# EAGLE design Filamint Schematic V4.5 (EAGLE 7.5.0)
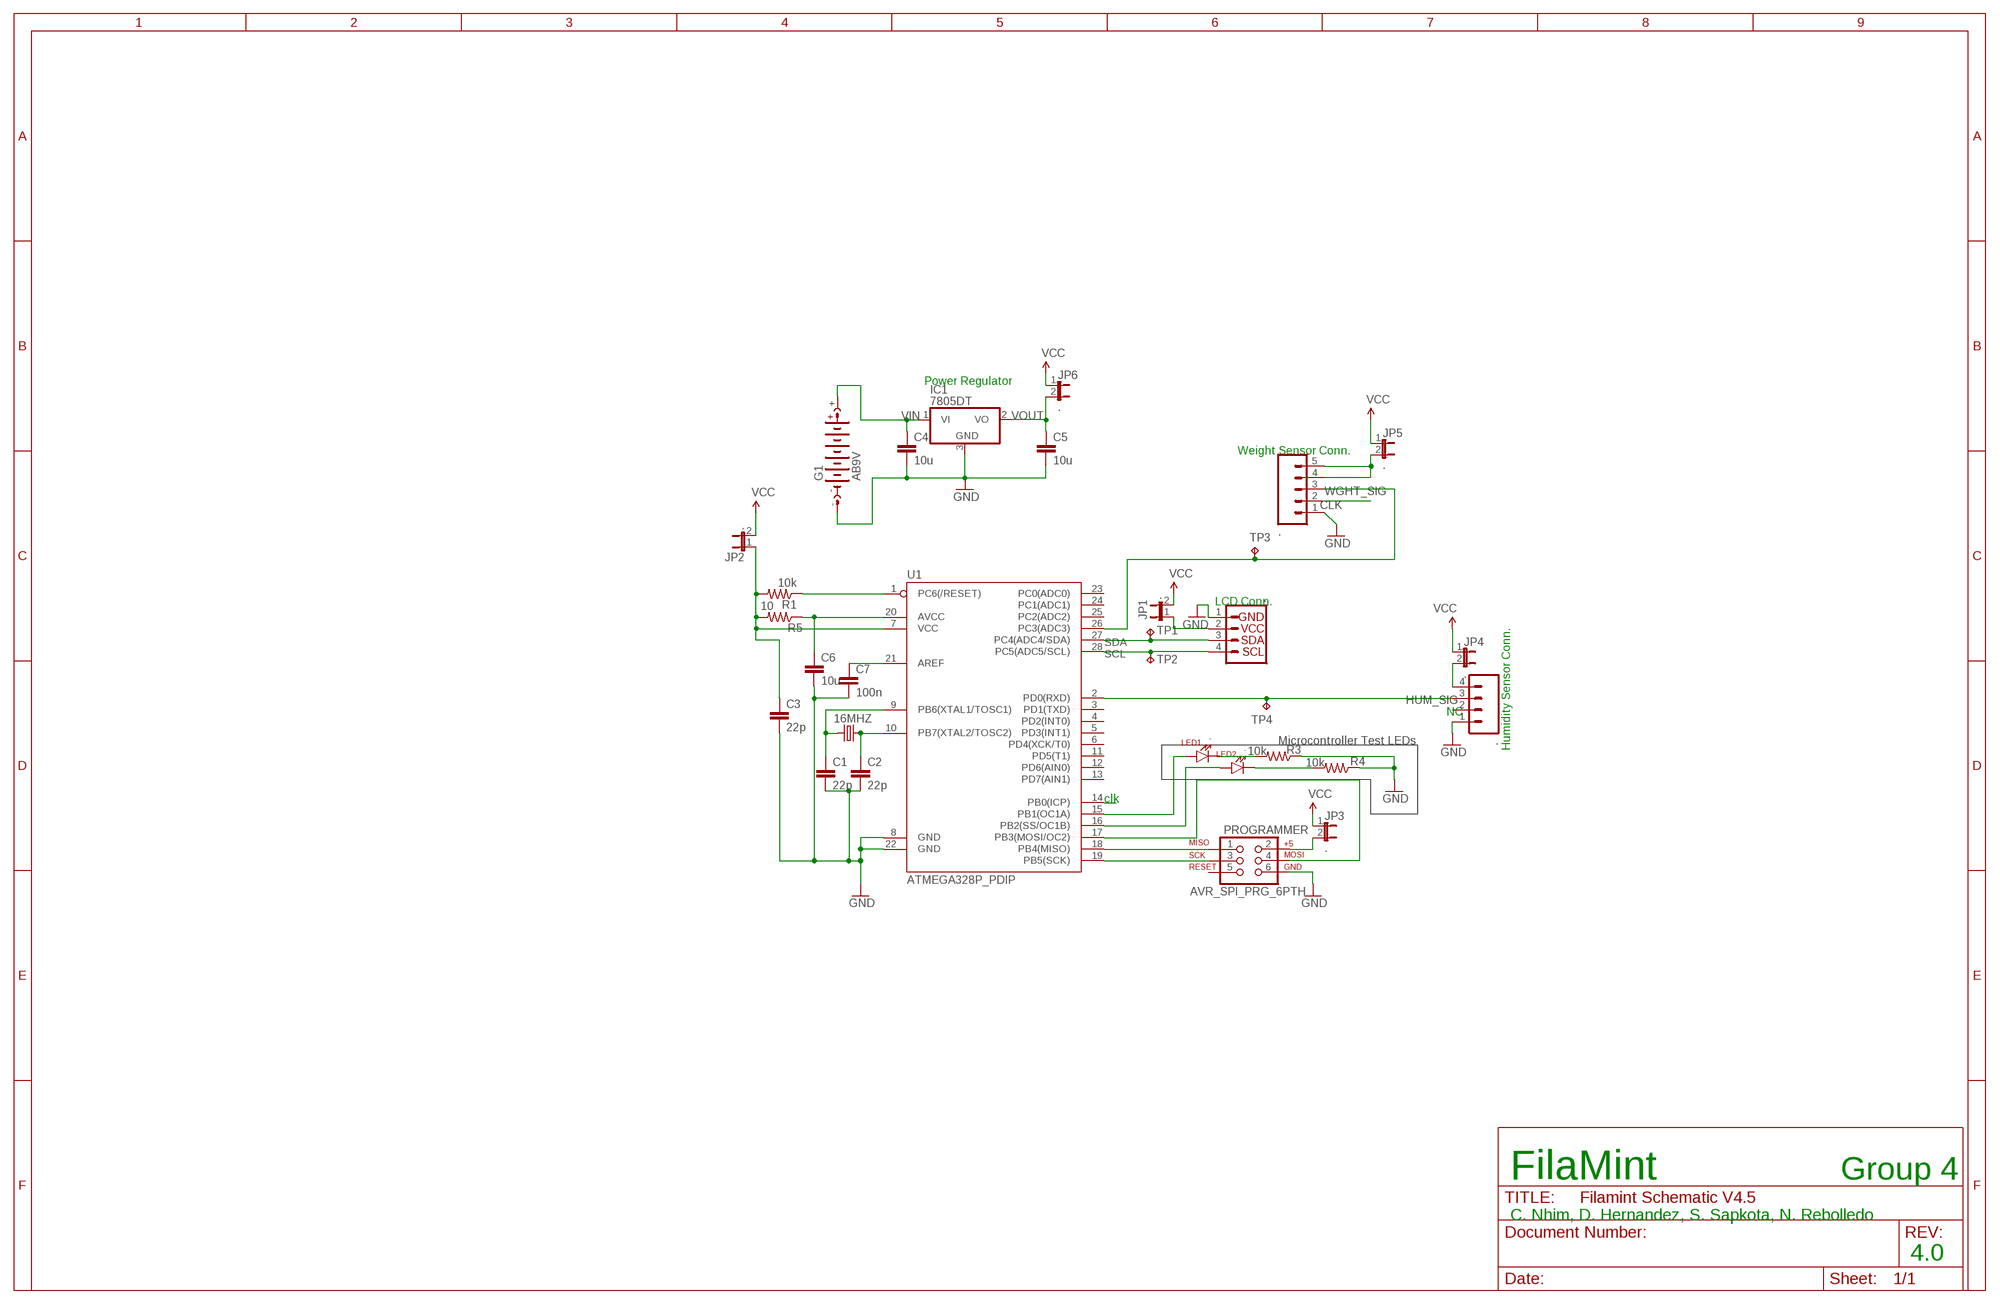
[diagram p0: schematic, sheet 1]

## Parts
16MHZ  CSM-7X-DU  [CSM-7X-DU]
C1  22p  C-EU025-024X044  [C025-024X044]
C2  22p  C-EU025-024X044  [C025-024X044]
C3  22p  C-EU025-024X044  [C025-024X044]
C4  10u  C-EU025-024X044  [C025-024X044]
C5  10u  C-EU025-024X044  [C025-024X044]
C6  10u  C-EU025-024X044  [C025-024X044]
C7  100n  C-EU025-024X044  [C025-024X044]
DHT22  .  M04SMD2  [1X04-1MM-RA]
G1  AB9V  [AB9V]
HX711  .  M05SMD  [1X05-1MM]
IC1  7805DT  [TO252]
JP1  .  JP1E  [JP1]
JP2  .  JP1E  [JP1]
JP3  .  JP1E  [JP1]
JP4  .  JP1E  [JP1]
JP5  .  JP1E  [JP1]
JP6  .  JP1E  [JP1]
LCD  .  I2C_STANDARD  [1X04]
LED1  .  LTE-302  [LTE-302]
LED2  .  LTE-302  [LTE-302]
PROGRAMMER  AVR_SPI_PRG_6PTH  [2X3]
R1  10k  R-US_0204/5  [0204/5]
R3  10k  R-US_0204/5  [0204/5]
R4  10k  R-US_0204/5  [0204/5]
R5  10  R-US_0204/5  [0204/5]
TP1  TPB1,27  [B1,27]
TP2  TPB1,27  [B1,27]
TP3  TPB1,27  [B1,27]
TP4  TPB1,27  [B1,27]
U1  ATMEGA328P_PDIP  [DIL28-3]

## Nets
AVCC: C6.1 R5.1 U1.20(AVCC)
CLK: HX711.2 U1.14(PB0(ICP))
GND: C1.2 C2.2 C3.2 C4.2 C5.2 C6.2 C7.2 DHT22.1 G1.- HX711.1 IC1.3(GND) LCD.1 PROGRAMMER.6 R3.1 R4.1 U1.8(GND) U1.22(GND)
HUM_SIG: DHT22.3 TP4.TP U1.2(PD0(RXD))
N$1: 16MHZ.2 C1.1 U1.9(PB6(XTAL1/TOSC1))
N$2: 16MHZ.1 C2.1 U1.10(PB7(XTAL2/TOSC2))
N$3: HX711.4 HX711.5 JP5.2
N$4: R1.1 U1.1(PC6(/RESET))
N$5: C7.1 U1.21(AREF)
N$6: PROGRAMMER.3 U1.19(PB5(SCK))
N$7: PROGRAMMER.1 U1.18(PB4(MISO))
N$11: LED1.A U1.15(PB1(OC1A))
N$12: PROGRAMMER.4 U1.17(PB3(MOSI/OC2))
N$22: LED2.A U1.16(PB2(SS/OC1B))
N$23: DHT22.4 JP4.2
N$24: LED1.C R3.2
N$25: LED2.C R4.2
N$26: JP3.2 PROGRAMMER.2
N$27: C3.1 JP2.1 R1.2 R5.2 U1.7(VCC)
N$28: JP1.1 LCD.2
N$29: C5.1 IC1.2(VO) JP6.2
SCL: LCD.4 TP2.TP U1.28(PC5(ADC5/SCL))
SDA: LCD.3 TP1.TP U1.27(PC4(ADC4/SDA))
VCC: JP1.2 JP2.2 JP3.1 JP4.1 JP5.1 JP6.1
VIN: C4.1 G1.+ IC1.1(VI)
WGHT_SIG: HX711.3 TP3.TP U1.26(PC3(ADC3))
Unconnected: DHT22.2 PROGRAMMER.5 U1.3(PD1(TXD)) U1.4(PD2(INT0)) U1.5(PD3(INT1)) U1.6(PD4(XCK/T0)) U1.11(PD5(T1)) U1.12(PD6(AIN0)) U1.13(PD7(AIN1)) U1.23(PC0(ADC0)) U1.24(PC1(ADC1)) U1.25(PC2(ADC2))

## Notes on the sheet
- Power Regulator
- VOUT
- Weight Sensor Conn.
- LCD Conn.
- NC
- Microcontroller Test LEDs
- Humidity Sensor Conn.
- clk
- FilaMint | Group 4
- C. Nhim, D. Hernandez, S. Sapkota, N. Rebolledo
- 4.0

## Library data of the parts
16MHZ = crystal:CSM-7X-DU: SMD CRYSTAL Source: www.ecsxtal.com .. Crystal 3.6864MHz CSM_7X_DU.PDF; OC_FARNELL: unknown; OC_NEWARK: unknown
C1-C7 = rcl:C-EU: CAPACITOR, European symbol
DHT22 = SparkFun-Connectors:M04: Header 4 Standard 4-pin 0.1" header. Use with straight break away headers (SKU : PRT-00116), right angle break away headers (PRT-00553), swiss pins (PRT-00743), machine pins (PRT-00117), and female headers (PRT-00115). Molex polarized connector foot print use with SKU : PRT-08231 with associated crimp pins and housings. 1MM SMD Version SKU: PRT-10208
G1 = battery:AB9V: 9-V BATTERY CLIP
HX711 = SparkFun-Connectors:M05: Header 5 Standard 5-pin 0.1" header. Use with straight break away headers (SKU : PRT-00116), right angle break away headers (PRT-00553), swiss pins (PRT-00743), machine pins (PRT-00117), and female headers (PRT-00115). Molex polarized connector foot print use with SKU : PRT-08230 with associated crimp pins and housings.
IC1 = linear:78*: Positive VOLTAGE REGULATOR Source: http://cache.national.com/ds/LM/LM78L05.pdf http://www.fairchildsemi.com/ds/LM/LM7805.pdf
JP1-JP6 = jumper:JP1E: JUMPER
LCD = SparkFun-Connectors:I2C_STANDARD: SparkFun has standardized on a pinout for all I2C based sensor breakouts. This pinout allows I2C boards to be plugged directly into the headers on Arduino Uno compatible boards, and to be daisy chained easily.
LED1 LED2 = SparkFun-LED:LTE-302: Through-hole side-firing 940nm IR LED
PROGRAMMER = SparkFun-Connectors:AVR_SPI_PRG_6: AVR ISP 6 Pin This is the reduced ISP connector for AVR programming. Common on Arduino. This footprint will take up less PCB space and can be used with a 10-pin to 6-pin adapter such as SKU: BOB-08508 **Special note about "TEST_POINT" package. The stop mask is on the top side, so if you want your programming test points to be on the bottom of your board, make sure to place this package on the bottom side of the board. This also ensure that the orientation to program from the bottom side will be correct.
R1 R3-R5 = rcl:R-US_: RESISTOR, American symbol
TP1-TP4 = testpad:TP: Test pad
U1 = SparkFun-DigitalIC:ATMEGA328P_PDIP: uC used in the Arduino 32kb flash, 1k EEPROM, 2k SRAM This is the through-hole version of this chip.

## Net classes
0 default: clearance 0.205 mm

## Board
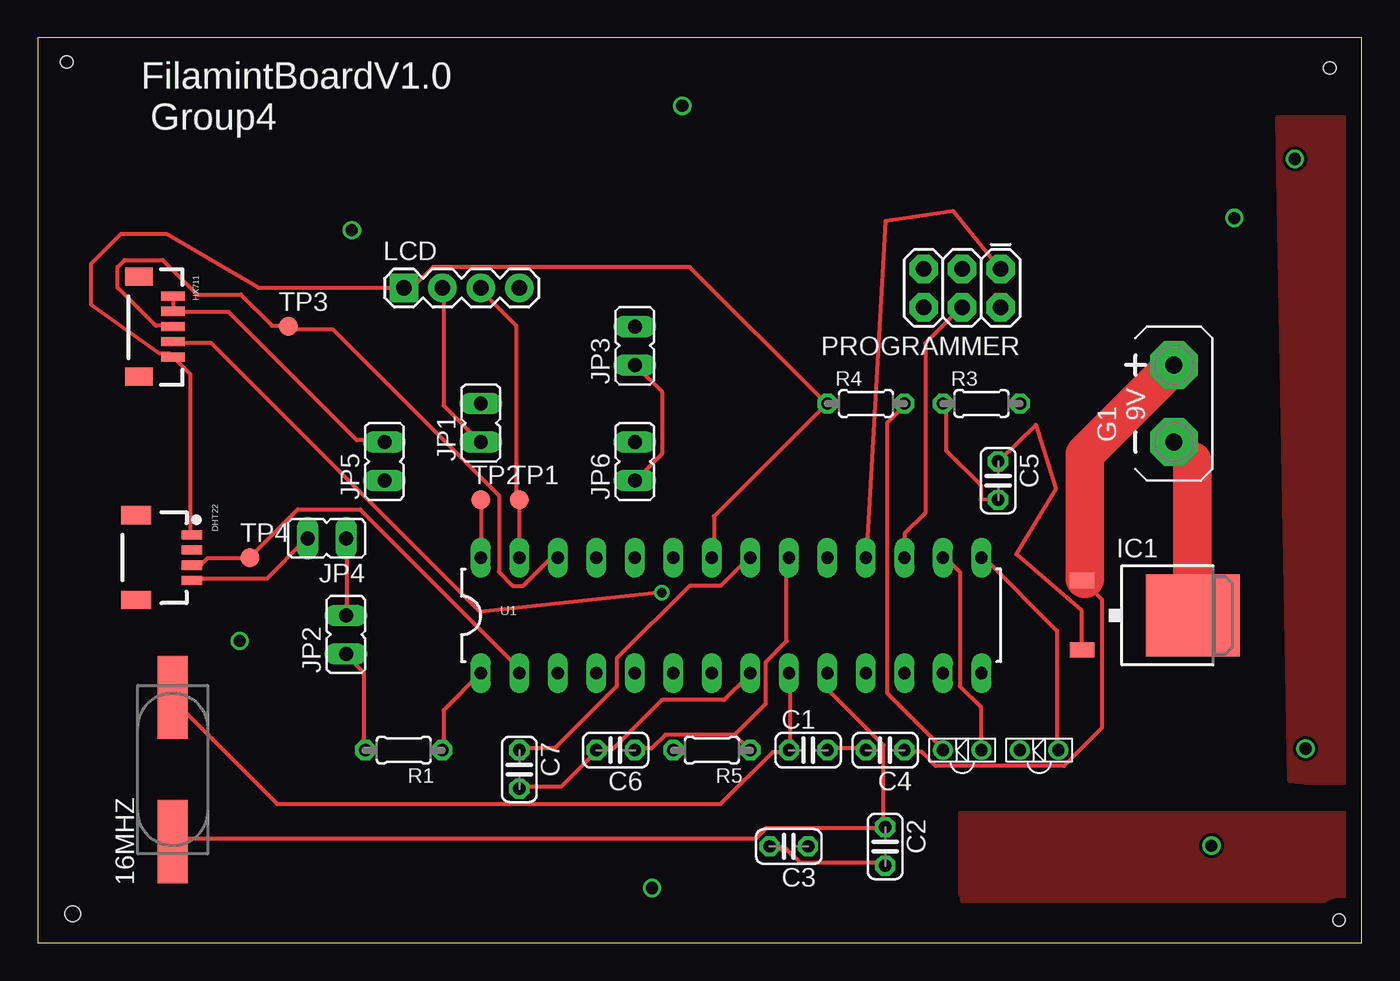
[diagram p1: board, top side]
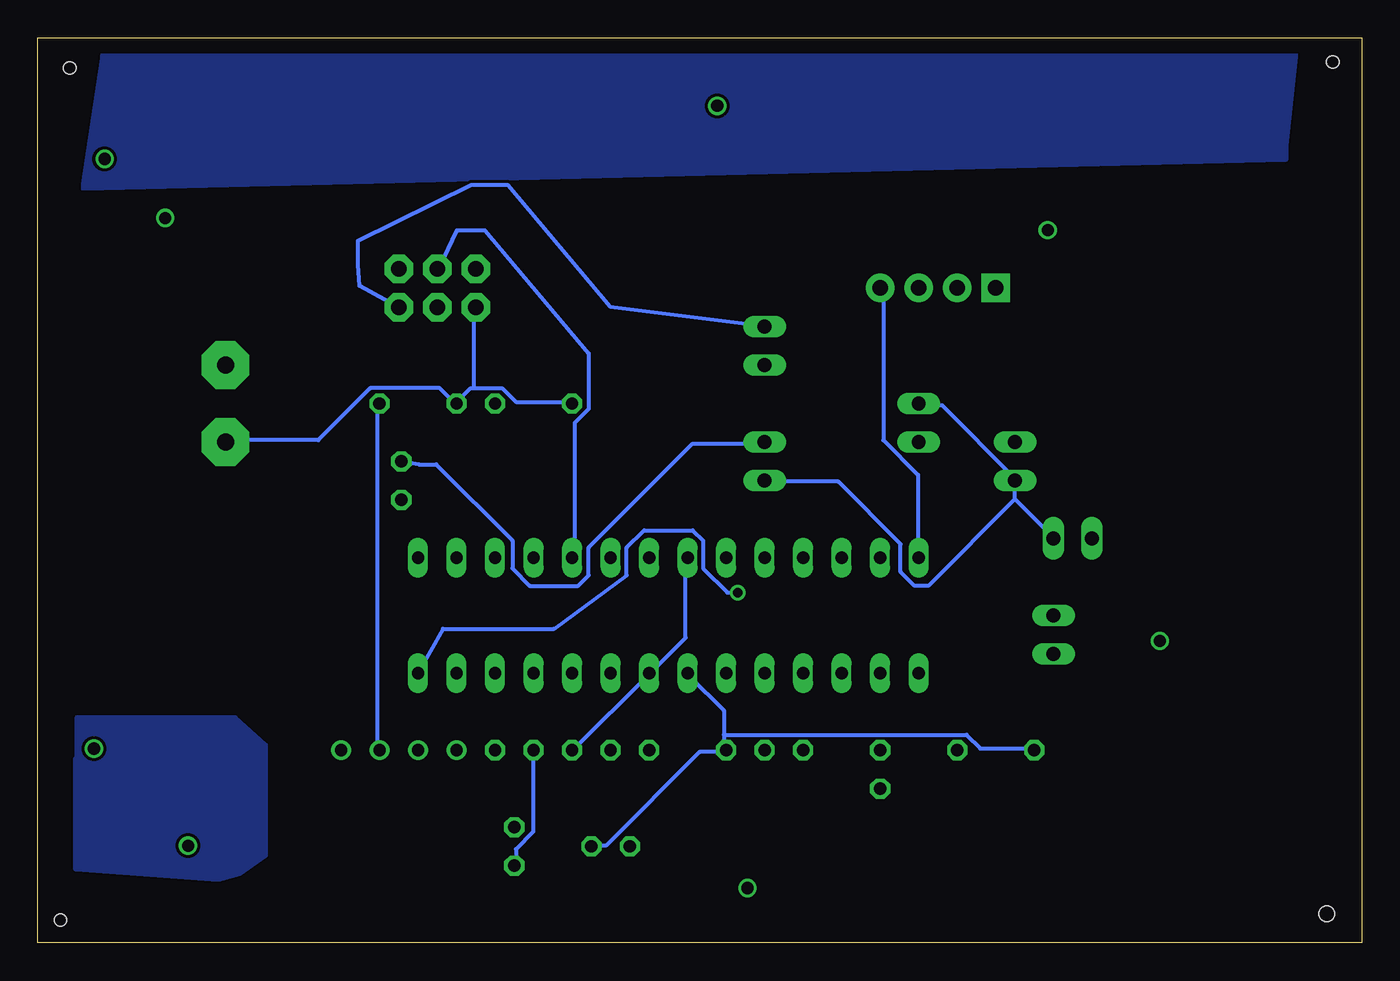
[diagram p2: board, bottom side, seen from below]

Size 87.3 x 59.68 mm. Coordinates in mm from the lower left corner, seen from the top.
Outline: 0,0 87.3,0 87.3,59.68 0,59.68 0,0
Copper layers (1*16): Top 0.035mm / dielectric 1.5mm / Bottom 0.035mm
Design rules "default": minimum track width 10mil, minimum drill 24mil, track to track 8mil, track to pad 8mil, pad to pad 8mil, via to via 8mil, smd to smd 8mil, copper to edge 40mil, drill to drill 8mil, minimum pad ring 10mil, minimum via ring 8mil, stop-mask expansion 4mil, vias tented up to drill 0mil, thermal gap 10mil
Holes 1 mm at 2.3,1.9
Holes 0.8 mm at 85.8,1.5 85.2,57.7 1.9,58.1

### Footprints (pad centres in the part's own frame; a part is rotated, then mirrored left to right if it is on the bottom)
CSM-7X-DU = smd 5.5 x 2: 1 -4.75,0; 2 4.75,0
C025-024X044 = drill 0.813 octagon: 1 -1.27,0; 2 1.27,0
1X04-1MM-RA = smd 0.6 x 1.35: 1 -1.5,0; 2 -0.5,0; 3 0.5,0; 4 1.5,0 | smd 1.2 x 2: NC1 2.8,-3.675; NC2 -2.8,-3.675
AB9V = drill 1.118 pad 3.15 octagon: + 0,2.54; - 0,-2.54
1X05-1MM = smd 0.6 x 1.55: 1 -2,0; 2 -1,0; 3 0,0; 4 1,0; 5 2,0 | smd 1.2 x 1.8: NC1 -3.3,2.225; NC2 3.3,2.225
TO252 = smd 1 x 1.6: 1 -2.28,-4.8; 2 2.28,-4.8 | smd 5.4 x 6.2: 3 0,2.5
JP1 = drill 0.914 long: 1 0,-1.27; 2 0,1.27
1X04 = drill 1.016 pad 1.88 square: 1 0,0 | drill 1.016 pad 1.88: 2 2.54,0; 3 5.08,0; 4 7.62,0
LTE-302 = drill 0.8: A 1.27,0; C -1.27,0
2X3 = drill 1.016 pad 1.88 octagon: 1 0,0; 2 0,2.54; 3 2.54,0; 4 2.54,2.54; 5 5.08,0; 6 5.08,2.54
0204/5 = drill 0.813 octagon: 1 -2.54,0; 2 2.54,0
B1,27 = smd 1.27 x 1.27: TP 0,0
DIL28-3 = drill 0.813 long: 1 -16.51,-3.81; 2 -13.97,-3.81; 3 -11.43,-3.81; 4 -8.89,-3.81; 5 -6.35,-3.81; 6 -3.81,-3.81; 7 -1.27,-3.81; 8 1.27,-3.81; 9 3.81,-3.81; 10 6.35,-3.81; 11 8.89,-3.81; 12 11.43,-3.81; 13 13.97,-3.81; 14 16.51,-3.81; 15 16.51,3.81; 16 13.97,3.81; 17 11.43,3.81; 18 8.89,3.81; 19 6.35,3.81; 20 3.81,3.81; 21 1.27,3.81; 22 -1.27,3.81; 23 -3.81,3.81; 24 -6.35,3.81; 25 -8.89,3.81; 26 -11.43,3.81; 27 -13.97,3.81; 28 -16.51,3.81

### Placement (x,y rotation side)
16MHZ  8.89,11.43 90 top
C1  50.8,12.7 0 top
C2  55.88,6.35 270 top
C3  49.53,6.35 180 top
C4  55.88,12.7 180 top
C5  63.33,30.48 270 top
C6  38.1,12.7 180 top
C7  31.75,11.43 270 top
DHT22  10.16,25.4 270 top
G1  74.93,35.56 0 top
HX711  8.89,40.64 90 top
IC1  73.66,21.59 270 top
JP1  29.21,34.29 0 top
JP2  20.32,20.32 0 top
JP3  39.37,39.37 0 top
JP4  19.05,26.67 90 top
JP5  22.86,31.75 0 top
JP6  39.37,31.75 0 top
LCD  24.13,43.18 0 top
LED1  66.04,12.7 0 top
LED2  60.96,12.7 0 top
PROGRAMMER  63.5,44.45 180 top
R1  24.13,12.7 180 top
R3  62.23,35.56 0 top
R4  54.61,35.56 0 top
R5  44.45,12.7 180 top
TP1  31.75,29.21 0 top
TP2  29.21,29.21 0 top
TP3  16.51,40.64 0 top
TP4  13.97,25.4 0 top
U1  45.72,21.59 0 top

### Tracks (layer width: path | path; a pad name or v marks a point on that pad's centre or on a via)
AVCC
  Top 0.254: 45.95,13.72 41.38,13.72 40.46,12.8 39.55,12.8 C6.1 | 45.95,13.72 46.86,12.8 R5.1 | 45.95,13.72 48.01,15.77 48.01,18.52 49.38,19.89 49.38,25.38 U1.20
CLK  (via drill 0.61)
  Top 0.254: v41.15,23.09 29.16,21.82 11.43,39.55 8.91,39.55 HX711.2
  Bottom 0.254: v41.15,23.09 41.83,23.09 43.43,24.69 43.43,26.52 44.12,27.2 47.32,27.2 48.46,26.06 48.46,24.23 53.26,20.7 60.58,20.7 U1.14
GND
  Top 0.254: C3.2 48.46,6.17 49.38,6.17 50.29,5.26 55.78,5.26 C2.2 | C7.2 31.77,10.29 34.52,10.29 36.8,12.57 C6.2 37.03,12.8 37.95,12.8 41.15,16 45.26,16 46.86,17.6 U1.8 | C1.2 52.12,12.8 54.41,12.8 C4.2 | DHT22.1 10.06,26.98 10.06,37.49 8.91,38.63 HX711.1 8.69,38.86 8,38.86 3.53,42.06 3.53,44.81 5.49,46.76 8.46,46.76 14.55,43.2 24,43.2 LCD.1 24.23,43.2 24.69,43.2 26.06,44.58 42.98,44.58 51.89,35.66 R4.1 51.89,35.43 44.58,28.12 44.58,25.6 U1.22 | 76.12,31.77 74.98,32.92 G1.- | 76.12,21.72 IC1.3 | C5.2 62.18,29.26 62.18,30.18 59.89,32.46 59.89,35.43 R3.1
  Top 2.54: 76.12,31.77 76.12,21.72
  Bottom 0.254: C1.2 51.89,12.8 47.09,17.6 U1.8 46.86,17.83 44.58,20.12 44.58,25.38 U1.22 | C2.2 55.78,5.26 55.78,6.17 54.63,7.32 54.63,12.57 C4.2 | 58.52,36.58 58.75,36.58 59.66,35.66 R3.1 59.89,35.66 60.81,36.58 65.38,36.58 68.81,33.15 74.75,33.15 G1.- | 58.52,36.58 56.69,36.58 55.78,35.66 52.12,35.66 R4.1 | 58.52,36.58 58.52,41.83 PROGRAMMER.6
  pour Top (isolate 0.01): 86.4,2.8 61,2.8 61,3.2 60.9,3.2 60.9,8.5 86.2,8.5 86.2,8.6
  pour Bottom (isolate 0.01): 4.3,59.1 83,59.1 83,58.5 84.3,49.8 5,51.7 5,52.6
HUM_SIG
  Top 0.254: DHT22.3 10.29,24.92 10.74,24.92 11.2,25.38 13.95,25.38 TP4.TP 17.14,28.57 21.26,28.57 31.55,18.29 31.55,17.83 U1.2
N$1
  Top 0.254: U1.9 49.61,17.6 49.61,12.8 C1.1 49.38,12.57 48.46,12.57 45.03,9.14 15.77,9.14 8.91,16 16MHZ.2
N$2
  Top 0.254: U1.10 52.12,17.6 52.12,16.69 55.78,13.03 55.78,7.77 C2.1 55.78,7.54 48.01,7.54 47.32,6.86 8.91,6.86 16MHZ.1
N$3
  Top 0.254: HX711.5 8.91,42.52 8.91,41.83 HX711.4 8.91,41.6 12.57,41.6 21.03,33.15 22.86,33.15 JP5.2
N$4
  Top 0.254: U1.1 26.75,15.32 26.75,12.8 R1.1
N$5
  Top 0.254: C7.1 31.77,12.8 34.06,12.8 38.18,16.92 38.18,18.75 42.98,23.55 45.03,23.55 46.86,25.38 U1.21
N$6
  Bottom 0.254: U1.19 51.89,25.6 51.89,34.29 50.98,35.2 50.98,38.86 57.84,46.99 59.66,46.99 60.81,44.58 PROGRAMMER.3
N$7
  Top 0.254: U1.18 54.63,25.6 55.91,47.6 60.38,48.26 63.45,44.45 63.32,44.58 PROGRAMMER.1
N$8  (via drill 0.8)
  other vias: 20.7,47
N$9  (via drill 0.8)
  other vias: 42.5,55.2
N$10  (via drill 0.8)
  other vias: 78.9,47.8
N$11
  Top 0.254: LED1.A 67.21,12.8 67.21,20.57 62.41,25.38 U1.15
N$12
  Top 0.254: U1.17 57.15,26.98 58.52,28.35 58.52,39.55 60.81,41.83 PROGRAMMER.4
N$13  (via drill 0.8)
  other vias: 83.6,12.8
N$14  (via drill 0.8)
  other vias: 77.4,6.4
N$15  (via drill 0.8)
  other vias: 40.5,3.6
N$16  (via drill 0.8)
  other vias: 13.3,19.9
N$17
  pour Top: 81.8,54.4 86.1,54.4 86.9,10.6 83.6,10.6 82.6,10.7
N$18  (via drill 0.8)
  other vias: 82.9,51.7
N$19
  pour Bottom: 74.3,14.8 84.7,14.8 84.7,12.1 84.8,12.1 84.8,4.9 75.4,4.2 74,4.6 72.3,5.8 72.3,13
N$22
  Top 0.254: LED2.A 62.18,12.8 62.18,15.54 60.81,16.92 60.81,24.46 59.89,25.38 U1.16
N$23
  Top 0.254: DHT22.4 10.29,24 15.09,24 17.6,26.52 JP4.2
N$24
  Bottom 0.254: LED1.C 64.92,12.8 64.92,35.63 R3.2
N$25
  Top 0.254: LED2.C 59.66,12.8 56.01,16.46 56.01,34.29 57.15,35.43 R4.2
N$26
  Bottom 0.254: JP3.2 39.55,40.69 49.58,41.96 56.34,49.99 58.7,49.99 66.19,46.3 66.19,44.7 66.09,43.33 PROGRAMMER.2
N$27
  Top 0.254: R1.2 21.49,12.8 21.49,17.83 20.34,18.97 JP2.1
  Bottom 0.254: 42.06,13.72 42.06,15.32 44.35,17.6 U1.7 | 42.06,13.72 42.06,12.8 R5.2 42.06,12.57 43.66,12.57 49.84,6.4 50.75,6.4 C3.1 | 42.06,13.72 26.06,13.72 25.15,12.8 21.72,12.8 R1.2
N$28
  Top 0.254: JP1.1 29.03,33.15 26.75,35.43 26.75,42.98 LCD.2
N$29
  Top 0.254: IC1.2 68.81,19.43 68.81,21.95 64.52,25.63 67.12,29.93 65.81,34.15 C5.1
  Bottom 0.254: JP6.2 39.55,32.92 44.12,32.92 50.98,26.06 50.98,24.23 51.66,23.55 54.86,23.55 56.01,24.69 56.01,26.52 61.04,31.55 62.18,31.55 C5.1
SCL
  Top 0.254: TP2.TP 29.26,29.03 29.26,25.6 U1.28
  Bottom 0.254: U1.28 29.26,25.6 29.26,30.86 31.55,33.15 31.55,42.98 LCD.4
SDA
  Top 0.254: U1.27 31.77,25.6 31.77,29.03 TP1.TP 31.55,29.26 31.55,40.69 29.26,42.98 LCD.3
VCC
  Top 0.254: JP6.1 39.55,30.63 41.15,32.23 41.15,36.35 39.55,37.95 JP3.1 | JP2.2 20.34,21.72 20.34,26.52 JP4.1
  Bottom 0.254: 22.86,29.26 JP5.1 22.86,30.63 27.66,35.43 29.03,35.43 JP1.2 | 22.86,29.26 20.34,26.75 JP4.1 | 22.86,29.26 28.57,23.55 29.49,23.55 30.4,24.46 30.4,26.29 34.52,30.4 39.32,30.4 JP6.1
VIN
  Top 0.254: 69.04,24 IC1.1 69.04,23.77 70.18,22.63 70.18,14.17 67.67,11.66 59.21,11.66 58.29,12.57 57.15,12.57 C4.1 | 74.75,37.95 G1.+
  Top 2.54: 69.04,24 69.04,32.23 74.75,37.95
WGHT_SIG
  Top 0.254: HX711.3 8.69,40.69 7.77,40.69 5.26,43.2 5.26,44.58 5.71,45.03 8.23,45.03 10.52,42.75 13.39,42.75 15.44,40.69 16.46,40.69 TP3.TP 16.69,40.46 19.43,40.46 30.4,29.49 30.4,24.46 31.32,23.55 32,23.55 33.83,25.38 34.29,25.38 U1.26

### Text on the board
tPlace: FilamintBoardV1.0 | Group4